# Altium schematic sheet 02_Power.SchDoc: Power section
size A4; Author: Sasa Karanovic; Organization: Altium Limited; Revision: 04; SheetNumber: 2; SheetTotal: 4; PrjDate: 2023-09-29; PrjTime: 23:04; PrjName: OpenFAN Micro
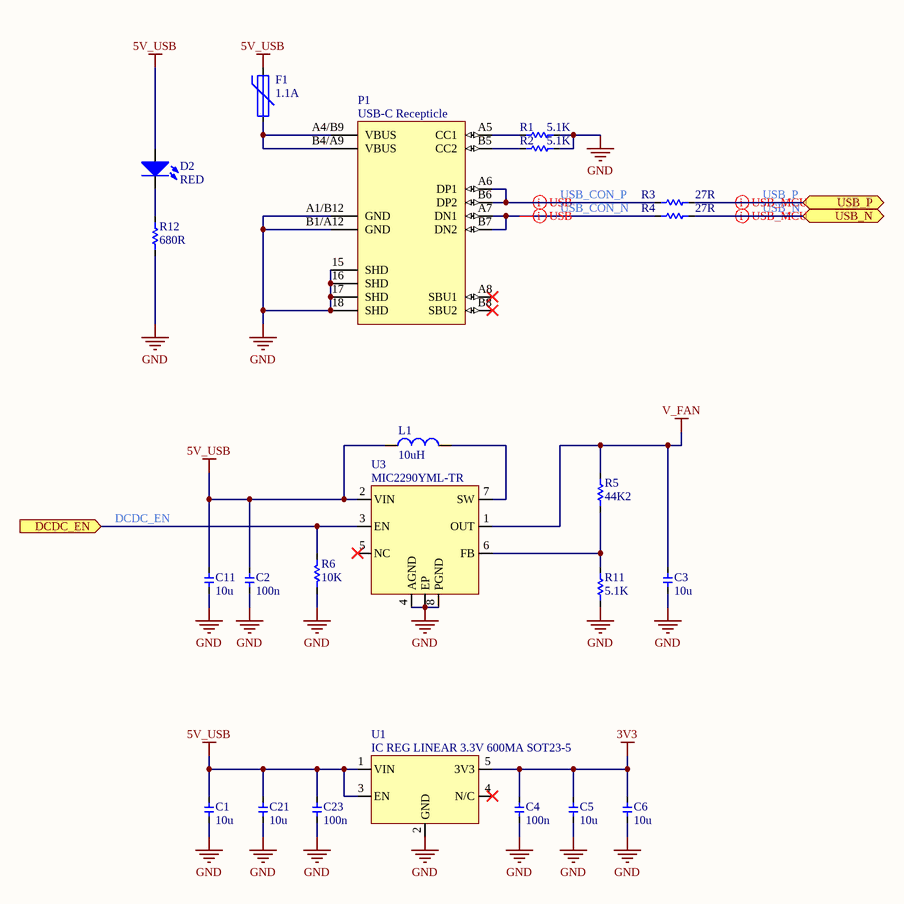
[diagram p0: 02_Power.SchDoc]

## Parts
C1  value 10u  [0402]  (hidden comment: Cap)
C2  value 100n  [0402]  (hidden comment: Cap)
C3  value 10u  [0805]  (hidden comment: Cap)
C4  value 100n  [0402]  (hidden comment: Cap)
C5  value 10u  [0603 - CAP]  (hidden comment: Cap)
C6  value 10u  [0603 - CAP]  (hidden comment: Cap)
C11  value 10u  [0402]  (hidden comment: Cap)
C21  value 10u  [0603 - CAP]  (hidden comment: Cap)
C23  value 100n  [0402]  (hidden comment: Cap)
D2  RED  [CD1608-0603]
F1  value 1.1A  [FUSE_2114X12N]  (hidden comment: Fuse)
L1  value 10uH  [INDC3218X20N]  (hidden comment: Inductor)
P1  USB-C Recepticle  [GCT_USB4105-GF-A]
R1  value 5.1K  [0402]  (hidden comment: Res)
R2  value 5.1K  [0402]  (hidden comment: Res)
R3  value 27R  [0402]  (hidden comment: Res)
R4  value 27R  [0402]  (hidden comment: Res)
R5  value 44K2  [0402]  (hidden comment: Res)
R6  value 10K  [0402]  (hidden comment: Res)
R11  value 5.1K  [0402]  (hidden comment: Res)
R12  value 680R  [0402]  (hidden comment: Res)
U1  IC REG LINEAR 3.3V 600MA SOT23-5  [SOT-23-5]
U3  MIC2290YML-TR  [SON50P200X85_HS-9N]

## Ports
DCDC_EN (in), USB_N (bidir), USB_P (bidir)

## Nets
3V3: C4.2 C5.2 C6.2 U1.5(3V3)
5V_USB: C1.2 C2.2 C11.2 C21.2 C23.2 D2.A F1.2 L1.1 U1.1(VIN) U1.3(EN) U3.2(VIN)
GND: C1.1 C2.1 C3.1 C4.1 C5.1 C6.1 C11.1 C21.1 C23.1 P1.15(SHD) P1.16(SHD) P1.17(SHD) P1.18(SHD) P1.A1/B12(GND) P1.B1/A12(GND) R1.2 R2.2 R6.1 R11.1 R12.1 U1.2(GND) U3.4(AGND) U3.8(PGND) U3.EP
V_FAN: C3.2 R5.2 U3.1(OUT)
DCDC_EN: R6.2 U3.3(EN) ; port DCDC_EN
USB_CON_N: P1.A7(DN1) P1.B7(DN2) R4.2
USB_CON_P: P1.A6(DP1) P1.B6(DP2) R3.2
USB_N: R4.1 ; port USB_N
USB_P: R3.1 ; port USB_P
NetD2_K: D2.K R12.2
NetF1_1: F1.1 P1.A4/B9(VBUS) P1.B4/A9(VBUS)
NetL1_2: L1.2 U3.7(SW)
NetP1_A5: P1.A5(CC1) R1.1
NetP1_B5: P1.B5(CC2) R2.1
NetR5_1: R5.1 R11.2 U3.6(FB)

Not connected (* = marked no-connect by the designer): P1 A8(SBU1)* B8(SBU2)*; U1 4(N/C)*; U3 5(NC)*

## Layout directives
differential pair; differential pair class USB_90: USB_N, USB_P
differential pair; differential pair class USB; differential pair class USB_90: USB_CON_N, USB_CON_P

## Notes on the sheet
- Page:
- Drawn By:
- Project:
- Rev:
- Time:
- Date:
- Sheet
- of

## Library data of the parts
C1 = Cap: Capacitor; Manufacturer: Murata Electronics; Manufacturer Part Number: GRM155R61A106ME11D; Voltage: 10V; Temp Rating: X7R; Distributor Part Number: C408132; Distributor: LCSC
C2 C4 C23 = Cap: Capacitor; Manufacturer: Samsung Electro-Mechanics; Manufacturer Part Number: CL05B104KA5NNNC; Voltage: 25V; Temp Rating: X7R; Distributor Part Number: C155422; Distributor: LCSC
C3 = Cap: Capacitor; Manufacturer: Samsung Electro-Mechanics; Manufacturer Part Number: CL21B106KOQNNNE; Voltage: 16V; Temp Rating: X7R; Distributor Part Number: C95841; Distributor: LCSC
C5 C6 C21 = Cap: Capacitor; Manufacturer: Murata Electronics; Manufacturer Part Number: GRM188Z71A106KA73D; Voltage: 10V; Temp Rating: X7R; Distributor Part Number: C2959727; Distributor: LCSC
C11 = Cap: Capacitor; Manufacturer: Murata Electronics; Manufacturer Part Number: GRM155R61A106ME11D; Temp Rating: X7R; Voltage: 10V; Distributor Part Number: C408132; Distributor: LCSC
D2 = LED-0603-5mA-RED: 5mA 26.05mcd 无色透明透镜 -30℃~+85℃ 631nm Red 130° 50mW 2V 0603 Light Emitting Diodes (LED) ROHS; Manufacturer: Lite-On; Manufacturer Part Number: LTST-C193KRKT-5A; Distributor: LCSC; Distributor Part Number: C157741; Color: RED; Test Current: 5mA
F1 = Fuse-PTC-0805-0.5A_6V: 6V 1.1A 40A 2.2A 0805 Resettable Fuses ROHS; Manufacturer: BOURNS; Manufacturer Part Number: MF-PSMF110X-2; Distributor: LCSC; Distributor Part Number: C89658
L1 = L-2520-10uH 850mA 480mOhm: 10 µH Shielded Drum Core, Wirewound Inductor 850 mA 480mOhm Max 1008 (2520 Metric); Manufacturer: Pulse Electronics; Manufacturer Part Number: BWMR00252012100M00; Distributor: LCSC; Distributor Part Number: C3033274
P1 = USB-C Recepticle -USB-TYPE-C-019: 3A 1 Surface Mount 16P Female -25℃~+85℃ Type-C SMD USB Connectors ROHS; Manufacturer: DEALON; Manufacturer Part Number: USB-TYPE-C-019; Distributor Part Number: C2927039; Distributor: LCSC
R1 R2 R11 = Res: Resistor; Manufacturer: YAGEO; Manufacturer Part Number: RC0402FR-075K1L; Power Rating: 100mW; Tolerance: 1%; Distributor: LCSC; Distributor Part Number: C105872
R3 R4 = Res: Resistor; Manufacturer: YAGEO; Manufacturer Part Number: RC0402FR-0727RL; Power Rating: 100mW; Tolerance: 1%; Distributor: LCSC; Distributor Part Number: C138021
R5 = R-0603-44K2 1%: 44.2 kOhms ±1% 0.1W, 1/10W Chip Resistor 0603 (1608 Metric) Moisture Resistant Thick Film; Manufacturer: YAGEO; Manufacturer Part Number: RC0402FR-0744K2L; Power Rating: 100mW; Distributor: LCSC; Distributor Part Number: C354260; Tolerance: 1%
R6 = Res: Resistor; Manufacturer: YAGEO; Manufacturer Part Number: RC0402FR-0710KL; Distributor: LCSC; Distributor Part Number: C60490
R12 = R-0603-470R 1%: 470Ω 100mW Thick Film Resistors ±0.5% ±100ppm/℃ 0603 Chip Resistor - Surface Mount ROHS; Manufacturer: YAGEO; Manufacturer Part Number: RC0402FR-10680RL; Tolerance: 1%; Distributor: LCSC; Distributor Part Number: C6378047; Power Rating: 100mW
U1 = AP7366-33W5-7: 600mA null 3.3V positive 6V SOT-25 Linear Voltage Regulators (LDO) ROHS; Manufacturer: Diodes Incorporated; Distributor: LCSC; Distributor Part Number: C526385; Manufacturer Part Number: AP7366-33W5-7
U3 = MIC2290YML-TR: Boost Switching Regulator IC Positive Adjustable 2.5V 1 Output 750mA (Switch) 8-VFDFN Exposed Pad, 8-MLF®; Manufacturer: Microchip Technology; Distributor: LCSC; Distributor Part Number: C144214; Manufacturer Part Number: MIC2290YML-TR